# EAGLE design BUZZI-42 (EAGLE 5.03)
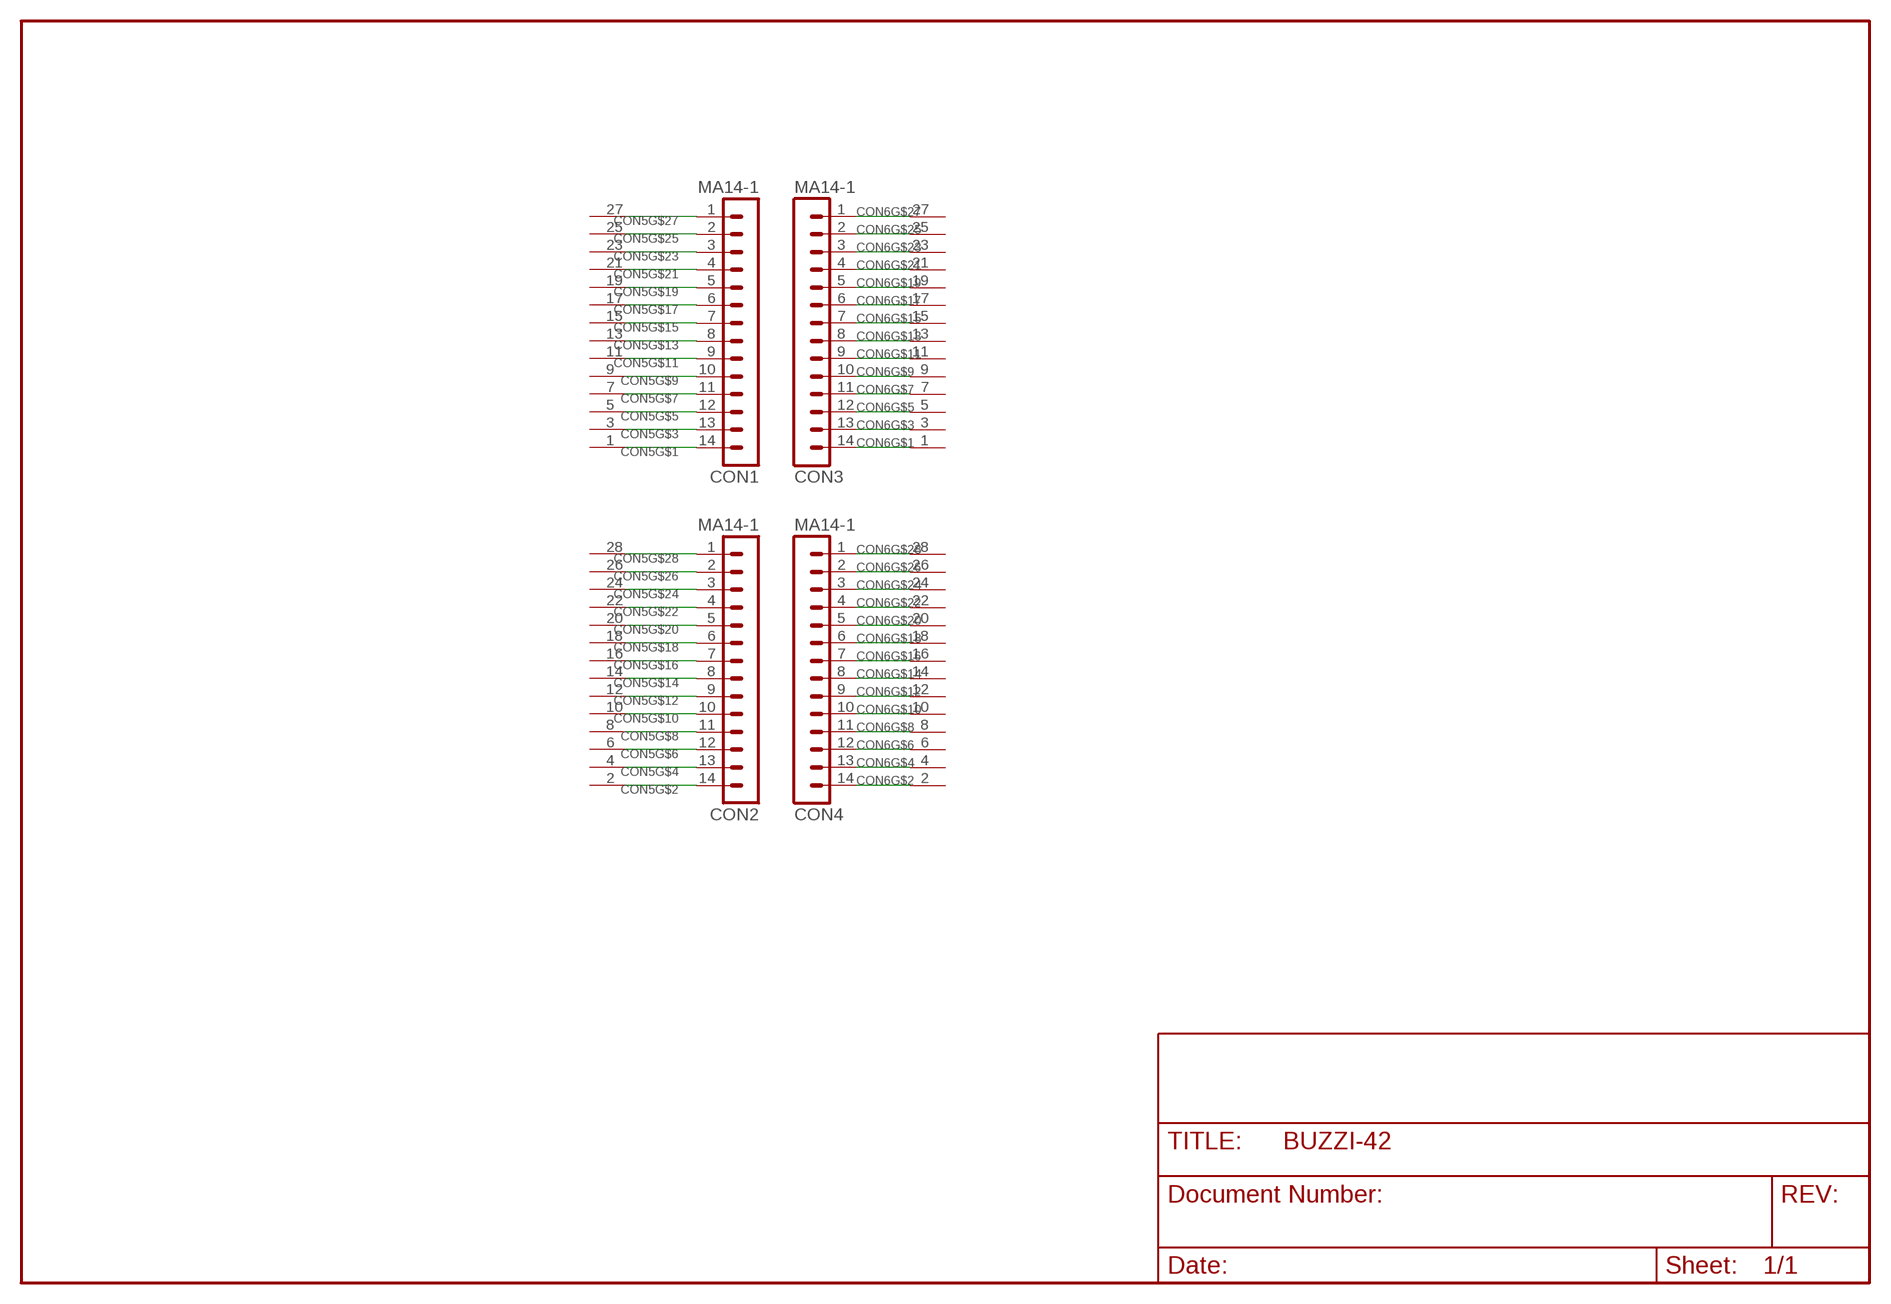
[diagram p0: schematic, sheet 1]

## Parts
CON1  MA14-1  [MA14-1]
CON2  MA14-1  [MA14-1]
CON3  MA14-1  [MA14-1]
CON4  MA14-1  [MA14-1]
CON5  CON28-2MM-SINGLE  [CON-28-2MM]
CON6  CON28-2MM-SINGLE  [CON-28-2MM]

## Nets
N$1: CON1.14 CON5.1
N$2: CON1.13 CON5.3
N$3: CON1.12 CON5.5
N$4: CON1.11 CON5.7
N$5: CON1.10 CON5.9
N$6: CON1.9 CON5.11
N$7: CON1.8 CON5.13
N$8: CON1.7 CON5.15
N$9: CON1.6 CON5.17
N$10: CON1.5 CON5.19
N$11: CON1.4 CON5.21
N$12: CON1.3 CON5.23
N$13: CON1.2 CON5.25
N$14: CON1.1 CON5.27
N$15: CON2.14 CON5.2
N$16: CON2.13 CON5.4
N$17: CON2.12 CON5.6
N$18: CON2.11 CON5.8
N$19: CON2.10 CON5.10
N$20: CON2.9 CON5.12
N$21: CON2.8 CON5.14
N$22: CON2.7 CON5.16
N$23: CON2.6 CON5.18
N$24: CON2.5 CON5.20
N$25: CON2.4 CON5.22
N$26: CON2.3 CON5.24
N$27: CON2.2 CON5.26
N$28: CON2.1 CON5.28
N$29: CON3.14 CON6.1
N$30: CON3.13 CON6.3
N$31: CON3.12 CON6.5
N$32: CON3.11 CON6.7
N$33: CON3.10 CON6.9
N$34: CON3.9 CON6.11
N$35: CON3.8 CON6.13
N$36: CON3.7 CON6.15
N$37: CON3.6 CON6.17
N$38: CON3.5 CON6.19
N$39: CON3.4 CON6.21
N$40: CON3.3 CON6.23
N$41: CON3.2 CON6.25
N$42: CON3.1 CON6.27
N$43: CON4.14 CON6.2
N$44: CON4.13 CON6.4
N$45: CON4.12 CON6.6
N$46: CON4.11 CON6.8
N$47: CON4.10 CON6.10
N$48: CON4.9 CON6.12
N$49: CON4.8 CON6.14
N$50: CON4.7 CON6.16
N$51: CON4.6 CON6.18
N$52: CON4.5 CON6.20
N$53: CON4.4 CON6.22
N$54: CON4.3 CON6.24
N$55: CON4.2 CON6.26
N$56: CON4.1 CON6.28

## Library data of the parts
CON1-CON4 = con-lstb:MA14-1
CON5 CON6 = turbod3:CON28-2MM-SINGLE

## Net classes
0 default: width 0.406 mm

## Board
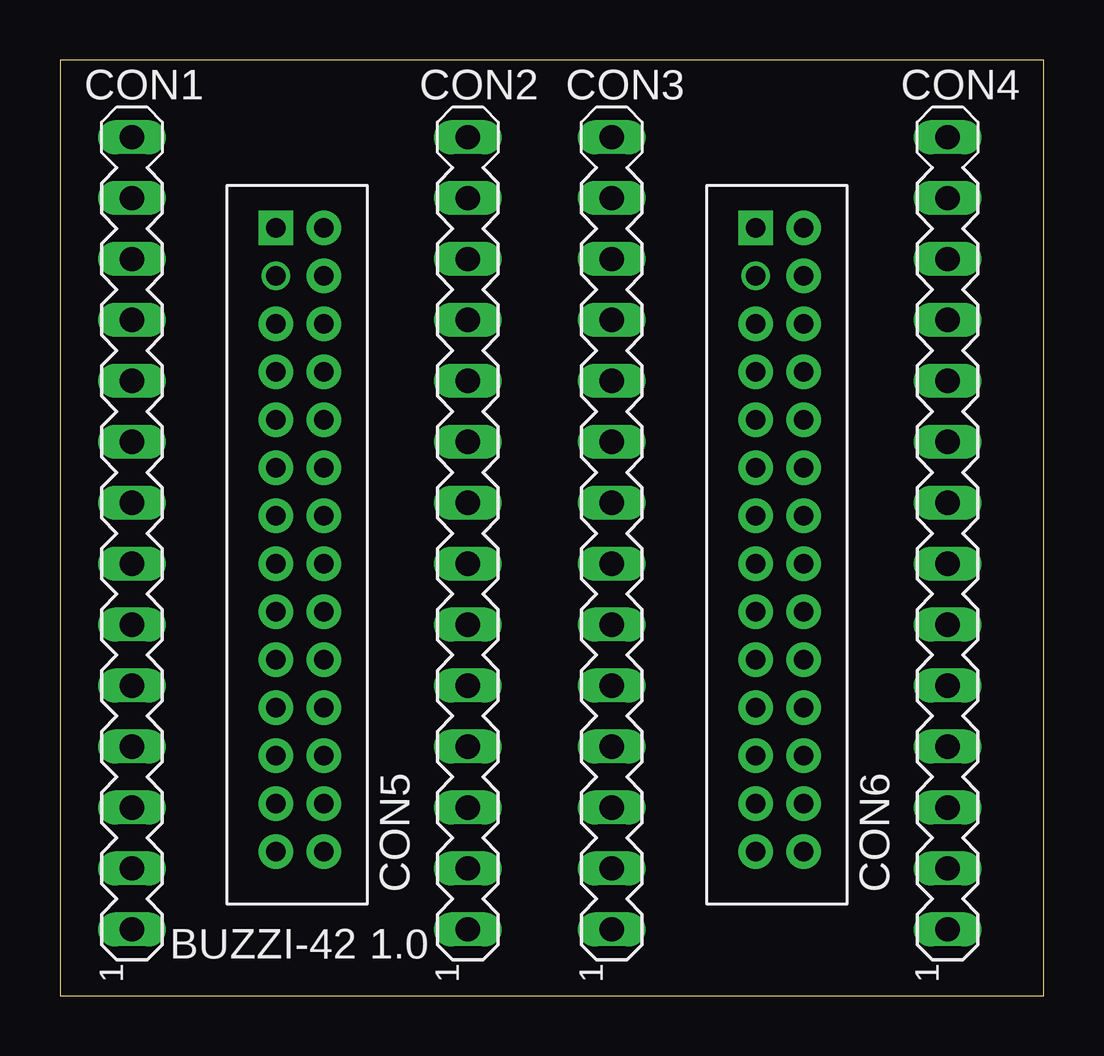
[diagram p1: board, top side]
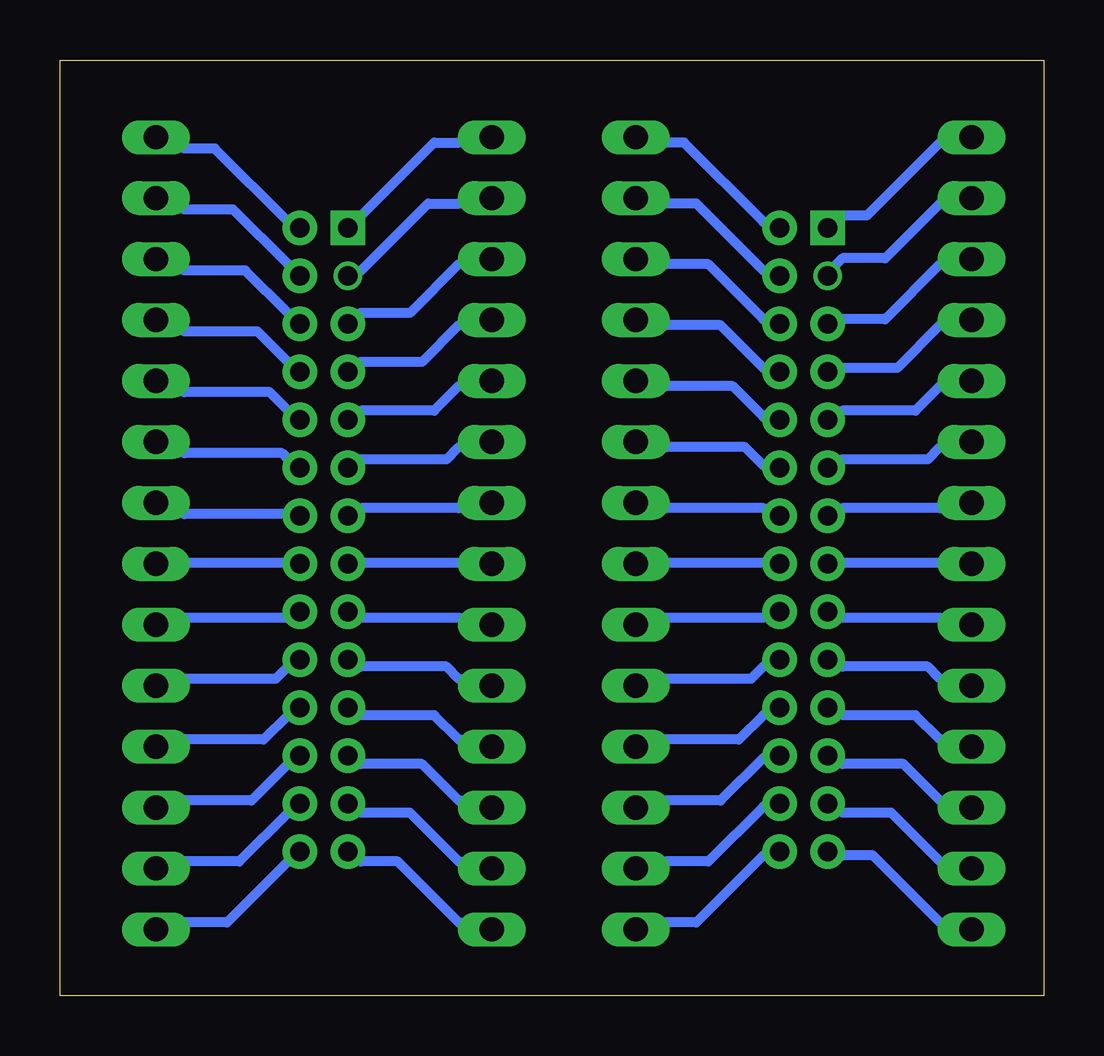
[diagram p2: board, bottom side, seen from below]

Size 41 x 39 mm. Coordinates in mm from the lower left corner, seen from the top.
Outline: 0,0 41,0 41,39 0,39 0,0
Copper layers (1*16): Top 0.035mm / dielectric 1.5mm / Bottom 0.035mm
Design rules "PCB-POOL": minimum track width 6mil, minimum drill 12mil, track to track 6mil, track to pad 6mil, pad to pad 6mil, via to via 6mil, smd to smd 6mil, copper to edge 20mil, drill to drill 8mil, minimum pad ring 8mil, minimum via ring 6mil, stop-mask expansion 3mil, vias tented up to drill 0mil, thermal gap 8mil

### Footprints (pad centres in the part's own frame; a part is rotated, then mirrored left to right if it is on the bottom)
MA14-1 = drill 1.016 long: 1 -15.24,0; 2 -12.7,0; 3 -10.16,0; 4 -7.62,0; 5 -5.08,0; 6 -2.54,0; 7 0,0; 8 2.54,0; 9 5.08,0; 10 7.62,0; 11 10.16,0; 12 12.7,0; 13 15.24,0; 14 17.78,0
CON-28-2MM = drill 0.8 pad 1.422 square: 1 0,0 | drill 0.8 pad 1.422 round: 2 2,0; 4 2,-2; 5 0,-4; 6 2,-4; 7 0,-6; 8 2,-6; 9 0,-8; 10 2,-8; 11 0,-10; 12 2,-10; 13 0,-12; 14 2,-12; 15 0,-14; 16 2,-14; 17 0,-16; 18 2,-16; 19 0,-18; 20 2,-18; 21 0,-20; 22 2,-20; 23 0,-22; 24 2,-22; 25 0,-24; 26 2,-24; 27 0,-26; 28 2,-26 | drill 0.8 round: 3 0,-2

### Placement (x,y rotation side)
CON1  3,18 90 top
CON2  17,18 90 top
CON3  23,18 90 top
CON4  37,18 90 top
CON5  9,32 0 top
CON6  29,32 0 top

### Tracks (layer width: path | path; a pad name or v marks a point on that pad's centre or on a via)
N$1
  Bottom 0.406: CON1.14 4.32,35.56 7.37,32.51 8.38,32.51 CON5.1
N$2
  Bottom 0.406: CON5.3 8.64,30.48 8.38,30.73 6.6,30.73 4.32,33.02 CON1.13
N$3
  Bottom 0.406: CON1.12 4.32,30.48 6.6,28.19 8.38,28.19 CON5.5
N$4
  Bottom 0.406: CON1.11 4.32,27.94 6.1,26.16 8.38,26.16 CON5.7
N$5
  Bottom 0.406: CON1.10 4.32,25.4 5.33,24.38 8.38,24.38 CON5.9
N$6
  Bottom 0.406: CON1.9 4.32,22.86 4.83,22.35 8.38,22.35 CON5.11
N$7
  Bottom 0.406: CON1.8 4.32,20.32 8.38,20.32 CON5.13
N$8
  Bottom 0.406: CON1.7 4.32,18.03 8.38,18.03 CON5.15
N$9
  Bottom 0.406: CON1.6 4.32,15.75 8.38,15.75 CON5.17
N$10
  Bottom 0.406: CON1.5 4.32,13.21 4.83,13.72 8.38,13.72 CON5.19
N$11
  Bottom 0.406: CON1.4 4.32,10.67 5.33,11.68 8.38,11.68 CON5.21
N$12
  Bottom 0.406: CON1.3 4.32,8.13 5.84,9.65 8.38,9.65 CON5.23
N$13
  Bottom 0.406: CON1.2 4.32,5.59 6.35,7.62 8.38,7.62 CON5.25
N$14
  Bottom 0.406: CON1.1 4.32,3.05 7.11,5.84 8.38,5.84 CON5.27
N$15
  Bottom 0.406: CON5.2 11.68,32.26 14.99,35.56 15.75,35.56 CON2.14
N$16
  Bottom 0.406: CON5.4 11.68,30.23 14.48,33.02 15.75,33.02 CON2.13
N$17
  Bottom 0.406: CON5.6 11.68,28.19 13.97,30.48 15.75,30.48 CON2.12
N$18
  Bottom 0.406: CON5.8 11.68,26.16 13.46,27.94 15.75,27.94 CON2.11
N$19
  Bottom 0.406: CON5.10 11.68,24.13 12.95,25.4 15.75,25.4 CON2.10
N$20
  Bottom 0.406: CON5.12 11.68,22.1 12.45,22.86 15.75,22.86 CON2.9
N$21
  Bottom 0.406: CON5.14 11.68,20.32 15.75,20.32 CON2.8
N$22
  Bottom 0.406: CON5.16 11.68,18.03 15.75,18.03 CON2.7
N$23
  Bottom 0.406: CON5.18 11.68,15.75 15.75,15.75 CON2.6
N$24
  Bottom 0.406: CON5.20 11.68,13.72 12.19,13.21 15.75,13.21 CON2.5
N$25
  Bottom 0.406: CON5.22 11.68,11.68 12.7,10.67 15.75,10.67 CON2.4
N$26
  Bottom 0.406: CON5.24 11.68,9.91 13.46,8.13 15.75,8.13 CON2.3
N$27
  Bottom 0.406: CON5.26 11.68,7.87 13.97,5.59 15.75,5.59 CON2.2
N$28
  Bottom 0.406: CON5.28 11.68,5.84 14.48,3.05 15.75,3.05 CON2.1
N$29
  Bottom 0.406: CON6.1 28.45,32.51 25.4,35.56 24.38,35.56 CON3.14
N$30
  Bottom 0.406: CON6.3 28.45,30.23 25.65,33.02 24.38,33.02 CON3.13
N$31
  Bottom 0.406: CON3.12 24.38,30.48 26.42,28.45 28.45,28.45 CON6.5
N$32
  Bottom 0.406: CON3.11 24.38,27.94 25.91,26.42 28.45,26.42 CON6.7
N$33
  Bottom 0.406: CON3.10 24.38,25.4 25.4,24.38 28.45,24.38 CON6.9
N$34
  Bottom 0.406: CON3.9 24.38,22.86 24.89,22.35 28.45,22.35 CON6.11
N$35
  Bottom 0.406: CON3.8 24.38,20.32 28.45,20.32 CON6.13
N$36
  Bottom 0.406: CON3.7 24.38,18.03 28.45,18.03 CON6.15
N$37
  Bottom 0.406: CON3.6 24.38,15.75 28.45,15.75 CON6.17
N$38
  Bottom 0.406: CON3.5 24.38,13.21 24.89,13.72 28.45,13.72 CON6.19
N$39
  Bottom 0.406: CON3.4 24.38,10.67 25.4,11.68 28.45,11.68 CON6.21
N$40
  Bottom 0.406: CON3.3 24.38,8.13 25.91,9.65 28.45,9.65 CON6.23
N$41
  Bottom 0.406: CON3.2 24.38,5.59 26.42,7.62 28.45,7.62 CON6.25
N$42
  Bottom 0.406: CON3.1 24.38,3.05 26.92,5.59 28.45,5.59 CON6.27
N$43
  Bottom 0.406: CON6.2 31.5,32.26 34.54,35.31 35.81,35.31 CON4.14
N$44
  Bottom 0.406: CON6.4 31.5,30.48 33.78,32.77 35.81,32.77 CON4.13
N$45
  Bottom 0.406: CON6.6 31.5,28.45 33.27,30.23 35.81,30.23 CON4.12
N$46
  Bottom 0.406: CON6.8 31.5,26.42 32.77,27.69 35.81,27.69 CON4.11
N$47
  Bottom 0.406: CON6.10 31.5,24.38 32.26,25.15 35.81,25.15 CON4.10
N$48
  Bottom 0.406: CON6.12 31.5,22.35 31.75,22.61 35.81,22.61 CON4.9
N$49
  Bottom 0.406: CON6.14 31.5,20.07 35.81,20.07 CON4.8
N$50
  Bottom 0.406: CON6.16 31.5,18.03 35.81,18.03 CON4.7
N$51
  Bottom 0.406: CON6.18 31.5,15.75 35.81,15.75 CON4.6
N$52
  Bottom 0.406: CON6.20 31.5,13.72 32,13.21 35.81,13.21 CON4.5
N$53
  Bottom 0.406: CON6.22 31.5,11.68 32.51,10.67 35.81,10.67 CON4.4
N$54
  Bottom 0.406: CON6.24 31.5,9.65 33.02,8.13 35.81,8.13 CON4.3
N$55
  Bottom 0.406: CON6.26 31.5,7.62 33.53,5.59 35.81,5.59 CON4.2
N$56
  Bottom 0.406: CON6.28 31.5,5.59 34.04,3.05 35.81,3.05 CON4.1

### Text on the board
tNames: BUZZI-42 1.0